# EAGLE design Main-PCB (EAGLE 7.7.0)
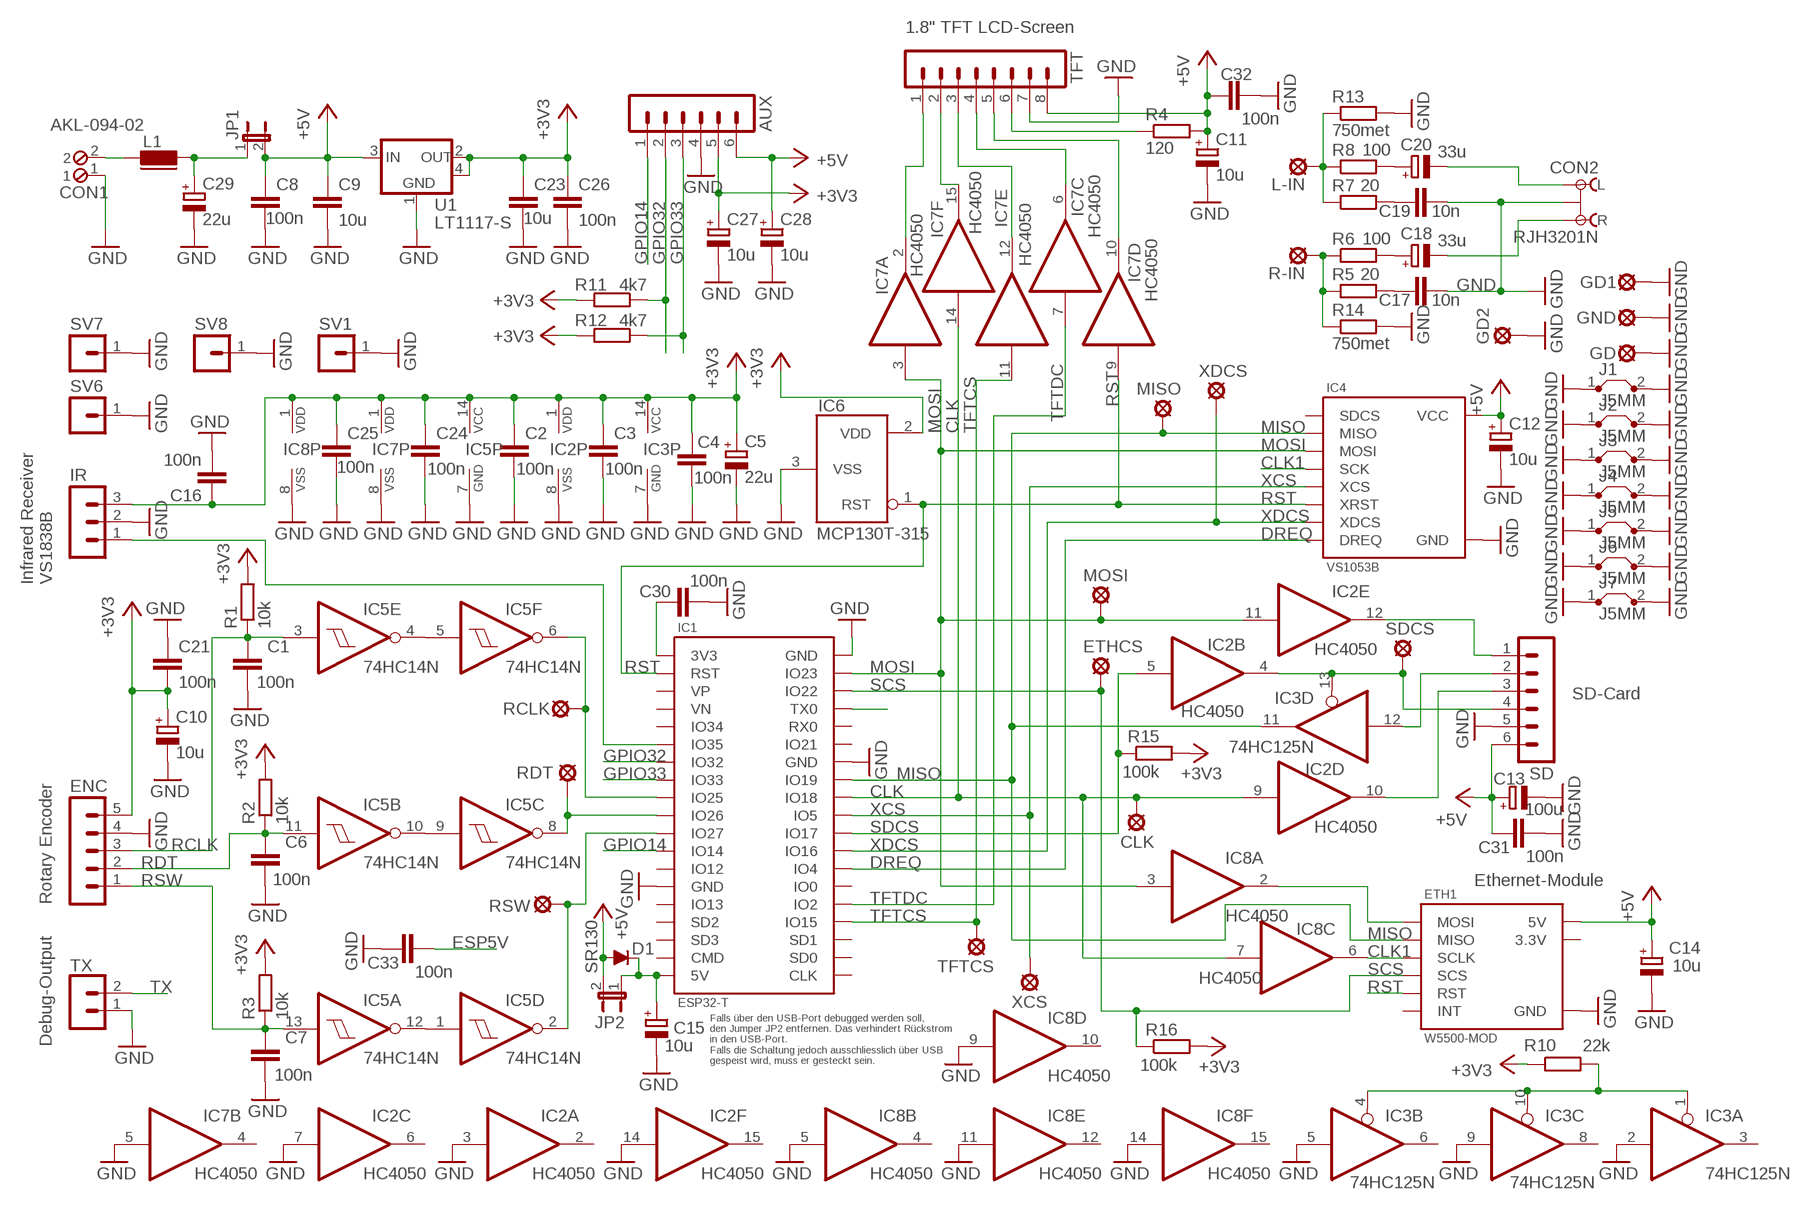
[diagram p0: schematic, sheet 1]

## Parts
AUX  MA06-1  [MA06-1]
C1  100n  C-EU050-024X044  [C050-024X044]
C2  100n  C-EUC1206  [C1206]
C3  100n  C-EUC1206  [C1206]
C4  100n  C-EUC1206  [C1206]
C5  22u  CPOL-EUTT2D4  [TT2D4]
C6  100n  C-EU050-024X044  [C050-024X044]
C7  100n  C-EU050-024X044  [C050-024X044]
C8  100n  C-EUC1206  [C1206]
C9  10u  C-EUC1206  [C1206]
C10  10u  CPOL-EUTT2D4  [TT2D4]
C11  10u  CPOL-EUTT2D4  [TT2D4]
C12  10u  CPOL-EUTT2D4L  [TT2D4L]
C13  100u  CPOL-EUE2.5-6  [E2,5-6]
C14  10u  CPOL-EUTT2D4  [TT2D4]
C15  10u  CPOL-EUTT2D4  [TT2D4]
C16  100n  C-EUC1206  [C1206]
C17  10n  C-EUC1206  [C1206]
C18  33u  CPOL-EUTT2D4  [TT2D4]
C19  10n  C-EUC1206  [C1206]
C20  33u  CPOL-EUTT2D4  [TT2D4]
C21  100n  C-EUC1206  [C1206]
C23  10u  C-EUC1206  [C1206]
C24  100n  C-EUC1206  [C1206]
C25  100n  C-EUC1206  [C1206]
C26  100n  C-EUC1206  [C1206]
C27  10u  CPOL-EUTT2D4  [TT2D4]
C28  10u  CPOL-EUTT2D4  [TT2D4]
C29  22u  CPOL-EUTT2D4  [TT2D4]
C30  100n  C-EUC1206  [C1206]
C31  100n  C-EUC1206  [C1206]
C32  100n  C-EUC1206  [C1206]
C33  100n  C-EUC1206  [C1206]
CLK  LSP11  [LSP11]
CON1  AKL-094-02  [AKL-094-02]
CON2  RJH3201N  [TECHNICS-RJH3201N]
D1  SR130  DIODE-D-7.5  [D-7.5]
ENC  MA05-1  [MA05-1]
ETH1  W5500-MOD  [W5500-MOD]
ETHCS  LSP11  [LSP11]
GD  LSP11  [LSP11]
GD1  LSP11  [LSP11]
GD2  SE13  [SE13]
GND  LSP11  [LSP11]
IC1  ESP32-T  [ESP32-T]
IC2  HC4050  4050N  [DIL16]
IC3  74HC125N  [DIL14]
IC4  VS1053B  [VS1053B]
IC5  74HC14N  [DIL14]
IC6  MCP130T-315  MCP130T-XXXSOT-23  [SOT-23]
IC7  HC4050  4050N  [DIL16]
IC8  HC4050  4050N  [DIL16]
IR  MA03-1  [MA03-1]
J1  J5MM  [05]
J2  J5MM  [05]
J3  J5MM  [05]
J4  J5MM  [05]
J5  J5MM  [05]
J6  J5MM  [05]
J7  J5MM  [05]
JP1  JP1E  [JP1]
JP2  JP1E  [JP1]
L1  07HCP  [07HCP]
L-IN  LSP11  [LSP11]
MISO  LSP11  [LSP11]
MOSI  LSP11  [LSP11]
R1  10k  R-EU_0207/10  [0207/10]
R2  10k  R-EU_0207/10  [0207/10]
R3  10k  R-EU_0207/10  [0207/10]
R4  120  R-EU_0207/10  [0207/10]
R5  20  R-EU_R1206  [R1206]
R6  100  R-EU_R1206  [R1206]
R7  20  R-EU_R1206  [R1206]
R8  100  R-EU_R1206  [R1206]
R10  22k  R-EU_R1206  [R1206]
R11  4k7  R-EU_R1206  [R1206]
R12  4k7  R-EU_R1206  [R1206]
R13  750met  R-EU_0207/10  [0207/10]
R14  750met  R-EU_0207/10  [0207/10]
R15  100k  R-EU_R1206  [R1206]
R16  100k  R-EU_R1206  [R1206]
R-IN  LSP11  [LSP11]
RCLK  LSP11  [LSP11]
RDT  LSP11  [LSP11]
RSW  LSP11  [LSP11]
SD  MA06-1  [MA06-1]
SDCS  LSP11  [LSP11]
SV1  MA01-1  [MA01-1]
SV6  MA01-1  [MA01-1]
SV7  MA01-1  [MA01-1]
SV8  MA01-1  [MA01-1]
TFT  MA08-1  [MA08-1]
TFTCS  LSP11  [LSP11]
TX  MA02-1  [MA02-1]
U1  LT1117-S  [SOT223]
XCS  LSP11  [LSP11]
XDCS  LSP11  [LSP11]

## Nets
+3V3: AUX.5 C2.1 C3.1 C4.1 C5.+ C10.+ C16.1 C21.2 C23.1 C24.1 C25.1 C26.1 C27.+ ENC.5 IC2.1(P:VDD) IC3.14(P:VCC) IC5.14(P:VCC) IC6.2(VDD) IC7.1(P:VDD) IC8.1(P:VDD) IR.3 R1.2 R2.2 R3.2 R10.1 R11.2 R12.2 R15.2 R16.2 U1.2(OUT) U1.4(TAB)
+5V: AUX.6 C8.1 C9.1 C11.+ C12.+ C13.+ C14.+ C28.+ C31.2 C32.2 D1.A ETH1.5V IC4.5V(VCC) JP1.2 JP2.2 R4.2 SD.6 TFT.8 U1.3(IN)
CLK: CLK.MP IC1.IO18 IC2.9(D:I) IC7.14(F:I) IC8.7(C:I)
CLK1: ETH1.SCLK IC4.SCK IC8.6(C:O)
DREQ: IC1.IO4 IC4.DREQ
ESP5V: C15.+ C33.1 D1.C IC1.5V JP2.1
ETHMOSI: ETH1.MOSI IC8.2(A:O)
GND: AUX.4 C1.2 C2.2 C3.2 C4.2 C5.- C6.2 C7.2 C8.2 C9.2 C10.- C11.- C12.- C13.- C14.- C15.- C16.2 C17.2 C19.2 C21.1 C23.2 C24.2 C25.2 C26.2 C27.- C28.- C29.- C30.2 C31.1 C32.1 C33.2 CON1.1 CON2.GND ENC.4 ETH1.GND GD1.MP GD2.MP GD.MP GND.MP IC1.GND IC1.GND1(GND) IC1.GND2(GND) IC2.3(A:I) IC2.7(C:I) IC2.8(P:VSS) IC2.14(F:I) IC3.2(A:I) IC3.5(B:I) IC3.7(P:GND) IC3.9(C:I) IC4.GND IC5.7(P:GND) IC6.3(VSS) IC7.5(B:I) IC7.8(P:VSS) IC8.5(B:I) IC8.8(P:VSS) IC8.9(D:I) IC8.11(E:I) IC8.14(F:I) IR.2 J1.1 J1.2 J2.1 J2.2 J3.1 J3.2 J4.1 J4.2 J5.1 J5.2 J6.1 J6.2 J7.1 J7.2 R13.2 R14.2 SD.5 SV1.1 SV6.1 SV7.1 SV8.1 TFT.7 TX.1 U1.1(GND)
GPIO14: AUX.1 IC1.IO14
GPIO32: AUX.2 IC1.IO32 R11.1
GPIO33: AUX.3 IC1.IO33 R12.1
IR: IC1.IO35 IR.1
MISO: ETH1.MISO IC1.IO19 IC3.11(D:O) IC4.MISO MISO.MP
MOSI: IC1.IO23 IC2.11(E:I) IC4.MOSI IC7.3(A:I) IC8.3(A:I) MOSI.MP
N$1: IC5.1(D:I) IC5.12(A:O)
N$2: IC5.4(E:O) IC5.5(F:I)
N$3: IC5.9(C:I) IC5.10(B:O)
N$4: R4.1 TFT.6
N$5: CON1.2 L1.1
N$6: IC1.IO25 IC5.6(F:O) RCLK.MP
N$7: IC1.IO26 IC5.8(C:O) RDT.MP
N$8: C29.+ JP1.1 L1.2
N$10: IC1.IO27 IC5.2(D:O) RSW.MP
N$11: C30.1 IC1.3V3
N$15: R5.1 R6.1 R14.1 R-IN.MP
N$17: C17.1 R5.2
N$19: C18.+ R6.2
N$20: C18.- CON2.R
N$22: L-IN.MP R7.1 R8.1 R13.1
N$23: C19.1 R7.2
N$25: C20.+ R8.2
N$26: C20.- CON2.L
N$27: IC3.1(A:OE) IC3.4(B:OE) IC3.10(C:OE) R10.2
RCLK: C1.1 ENC.3 IC5.3(E:I) R1.1
RDT: C6.1 ENC.2 IC5.11(B:I) R2.1
RST: ETH1.RST IC1.RST IC4.XRST IC6.1(RST) IC7.9(D:I)
RSW: C7.1 ENC.1 IC5.13(A:I) R3.1
SCS: ETH1.SCS ETHCS.MP IC1.IO22 R16.1
SDCLK: IC2.10(D:O) SD.3
SDCS: IC1.IO17 IC2.5(B:I) R15.1
SDCS1: IC2.4(B:O) IC3.13(D:OE) SD.4 SDCS.MP
SDMISO: IC3.12(D:I) SD.2
SDMOSI: IC2.12(E:O) SD.1
TFTCLK: IC7.15(F:O) TFT.2
TFTCS: IC1.IO15 IC7.11(E:I) TFTCS.MP
TFTCS1: IC7.12(E:O) TFT.3
TFTDC: IC1.IO2 IC7.7(C:I)
TFTDC1: IC7.6(C:O) TFT.4
TFTMOSI: IC7.2(A:O) TFT.1
TFTRST: IC7.10(D:O) TFT.5
TX: IC1.TX0 TX.2
XCS: IC1.IO5 IC4.XCS XCS.MP
XDCS: IC1.IO16 IC4.XDCS XDCS.MP
Unconnected: ETH1.INT IC1.CLK IC1.CMD IC1.IO0 IC1.IO12 IC1.IO13 IC1.IO21 IC1.IO34 IC1.RX0 IC1.SD0 IC1.SD1 IC1.SD2 IC1.SD3 IC1.VN IC1.VP IC2.2(A:O) IC2.6(C:O) IC2.15(F:O) IC3.3(A:O) IC3.6(B:O) IC3.8(C:O) IC4.SDCS IC7.4(B:O) IC8.4(B:O) IC8.10(D:O) IC8.12(E:O) IC8.15(F:O)

## Notes on the sheet
- 1.8" TFT LCD-Screen
- Infrared Receiver
  VS1838B
- SD-Card
- Ethernet-Module
- Rotary Encoder
- Debug-Output
- Falls über den USB-Port debugged werden soll,
  den Jumper JP2 entfernen. Das verhindert Rückstrom
  in den USB-Port.
  Falls die Schaltung jedoch ausschliesslich über USB
  gespeist wird, muss er gesteckt sein.

## Power pins joined to a net without a drawn wire
3.3V: ETH1.3.3V

## Library data of the parts
AUX SD = con-lstb:MA06-1: PIN HEADER; OC_FARNELL: unknown; OC_NEWARK: unknown
C1-C4 C6-C9 C16 C17 C19 C21 C23-C26 C30-C33 = rcl:C-EU: CAPACITOR, European symbol
C5 C10-C15 C18 C20 C27-C29 = rcl:CPOL-EU: POLARIZED CAPACITOR, European symbol
CLK ETHCS GD GD1 GND L-IN MISO MOSI R-IN RCLK RDT RSW SDCS TFTCS XCS XDCS = solpad:LSP11: SOLDER PAD drill 1.1 mm
CON1 = tj-library:AKL-094-02: Riacon AKL-094, Raster 5.08 mm, Polzahl 2
CON2 = tj-library:RJH3201N: RCA Stereo Connector from Technics Tuner ST-G570
D1 = diode:DIODE-: DIODE
ENC = con-lstb:MA05-1: PIN HEADER; OC_FARNELL: unknown; OC_NEWARK: unknown
ETH1 = tj-library:W5500-MOD: Wiznet W5500 Ethernet Modul (China Board)
GD2 = solpad:SE13: SOLDER PAD E1542, drill 1,3mm, distributor Buerklin, 07F815
IC1 = tj-library:ESP32-T: ESP32-T (China Board with ESP32-Bit Modul)
IC2 IC7 IC8 = 40xx:4050: Hex non-inverting BUFFER
IC3 = 74xx-eu:74*125: Quad bus BUFFER, 3-state
IC4 = tj-library:VS1053B: VS1053B Audio Module (China Board)
IC5 = 74xx-eu:74*14: Hex schmitt trigger INVERTER
IC6 = tj-library:MCP130T-XXX: Microcontroller Supervisory Circuit with Open Drain Output
IR = con-lstb:MA03-1: PIN HEADER; OC_FARNELL: unknown; OC_NEWARK: unknown
J1-J7 = jumper:J: Bridge
JP1 JP2 = jumper:JP1E: JUMPER
L1 = inductor-fastron:07HCP: Fastron Inductor 07HCP
R1-R8 R10-R16 = rcl:R-EU_: RESISTOR, European symbol
SV1 SV6-SV8 = tj-library:MA01-1: PIN HEADER
TFT = con-lstb:MA08-1: PIN HEADER; OC_FARNELL: unknown; OC_NEWARK: unknown
TX = tj-library:MA02-1: PIN HEADER
U1 = v-reg:LT1117: 800mA LDO Positive Regulator Fixed 2.85V, 3.3V, 5V

## Net classes
0 default: width 0.406 mm, clearance 0.305 mm
1 Stromversorgung: width 0.406 mm, clearance 0.356 mm
2 Stromversorgung 2: width 0.813 mm, clearance 0.406 mm

## Board
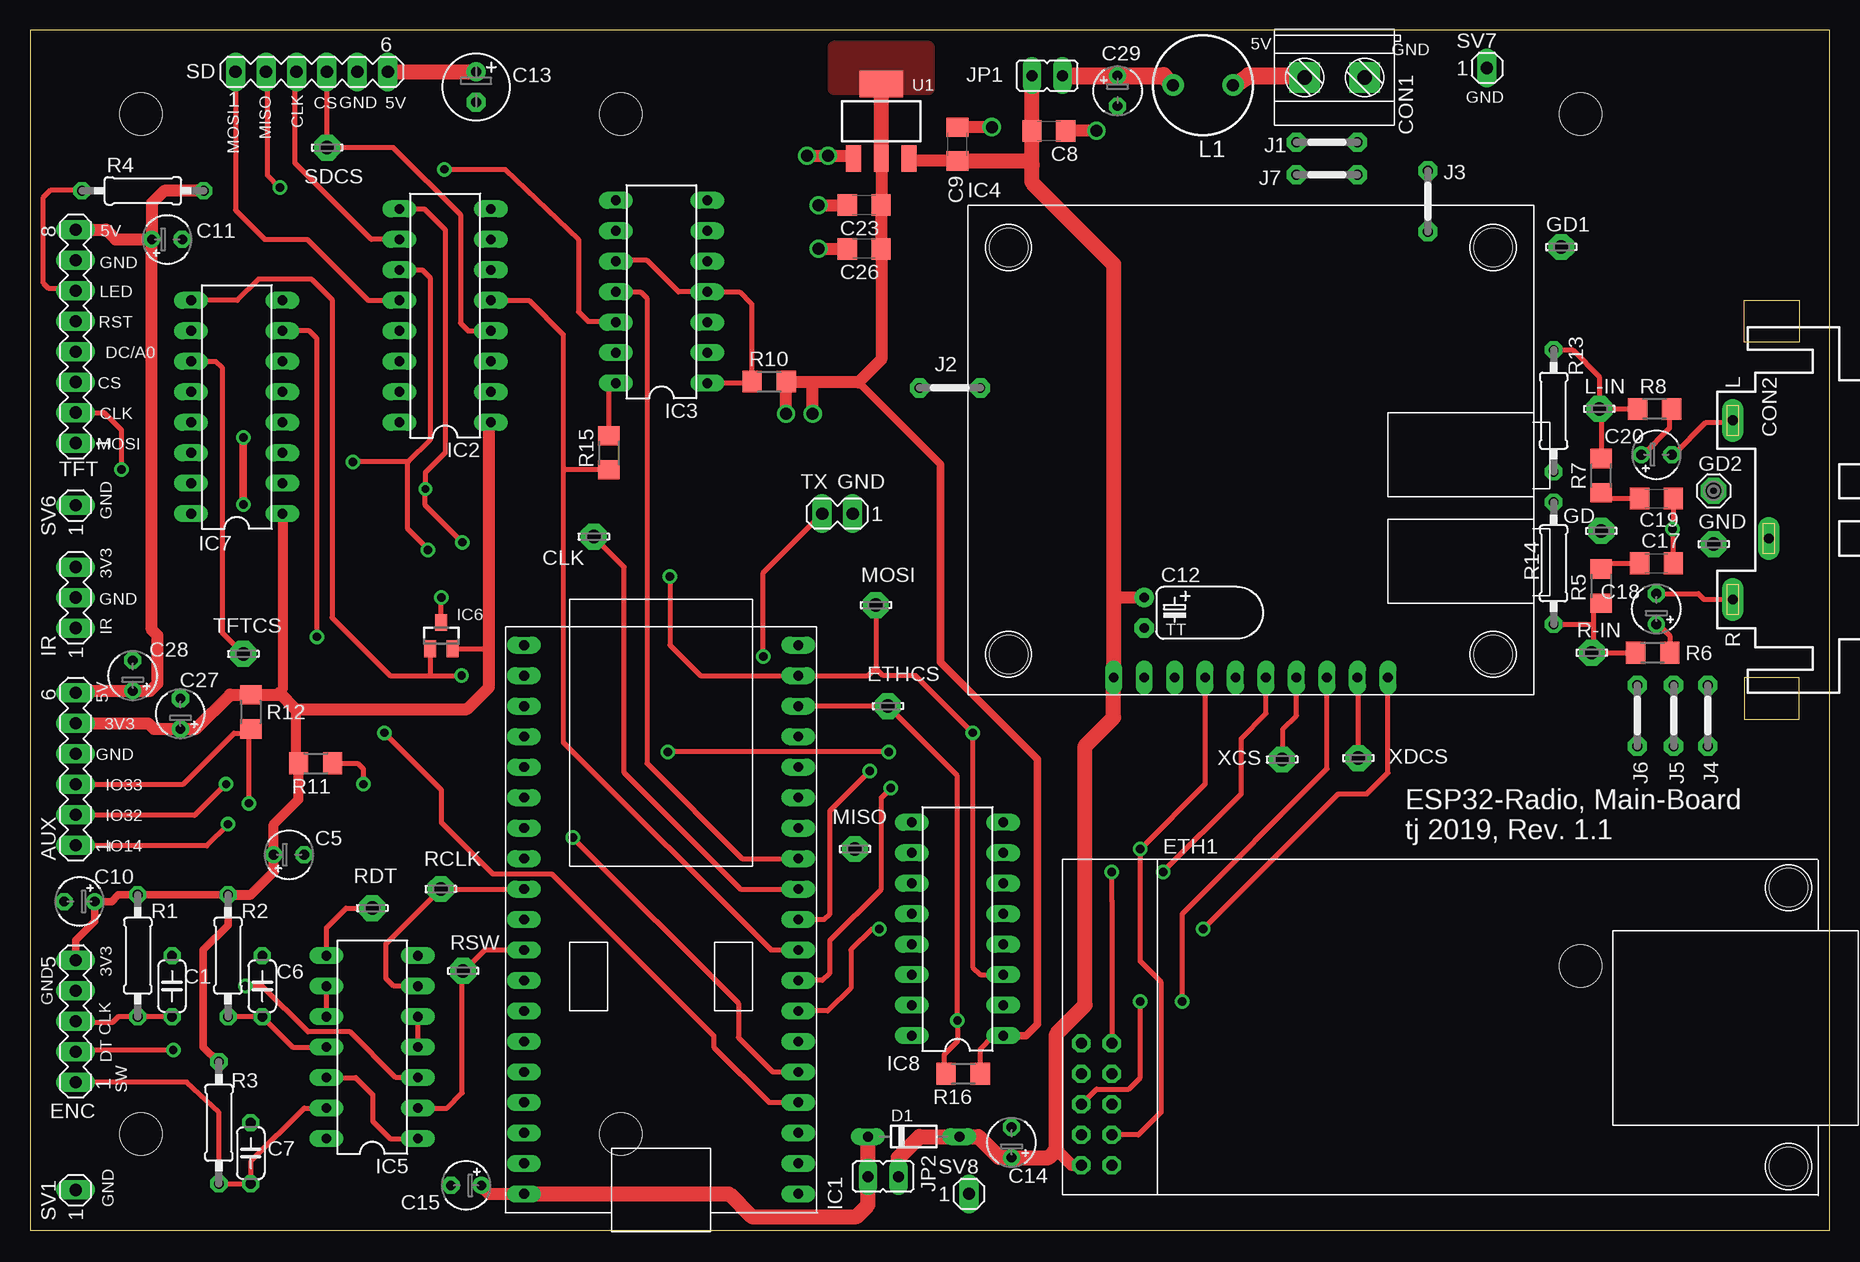
[diagram p1: board, top side]
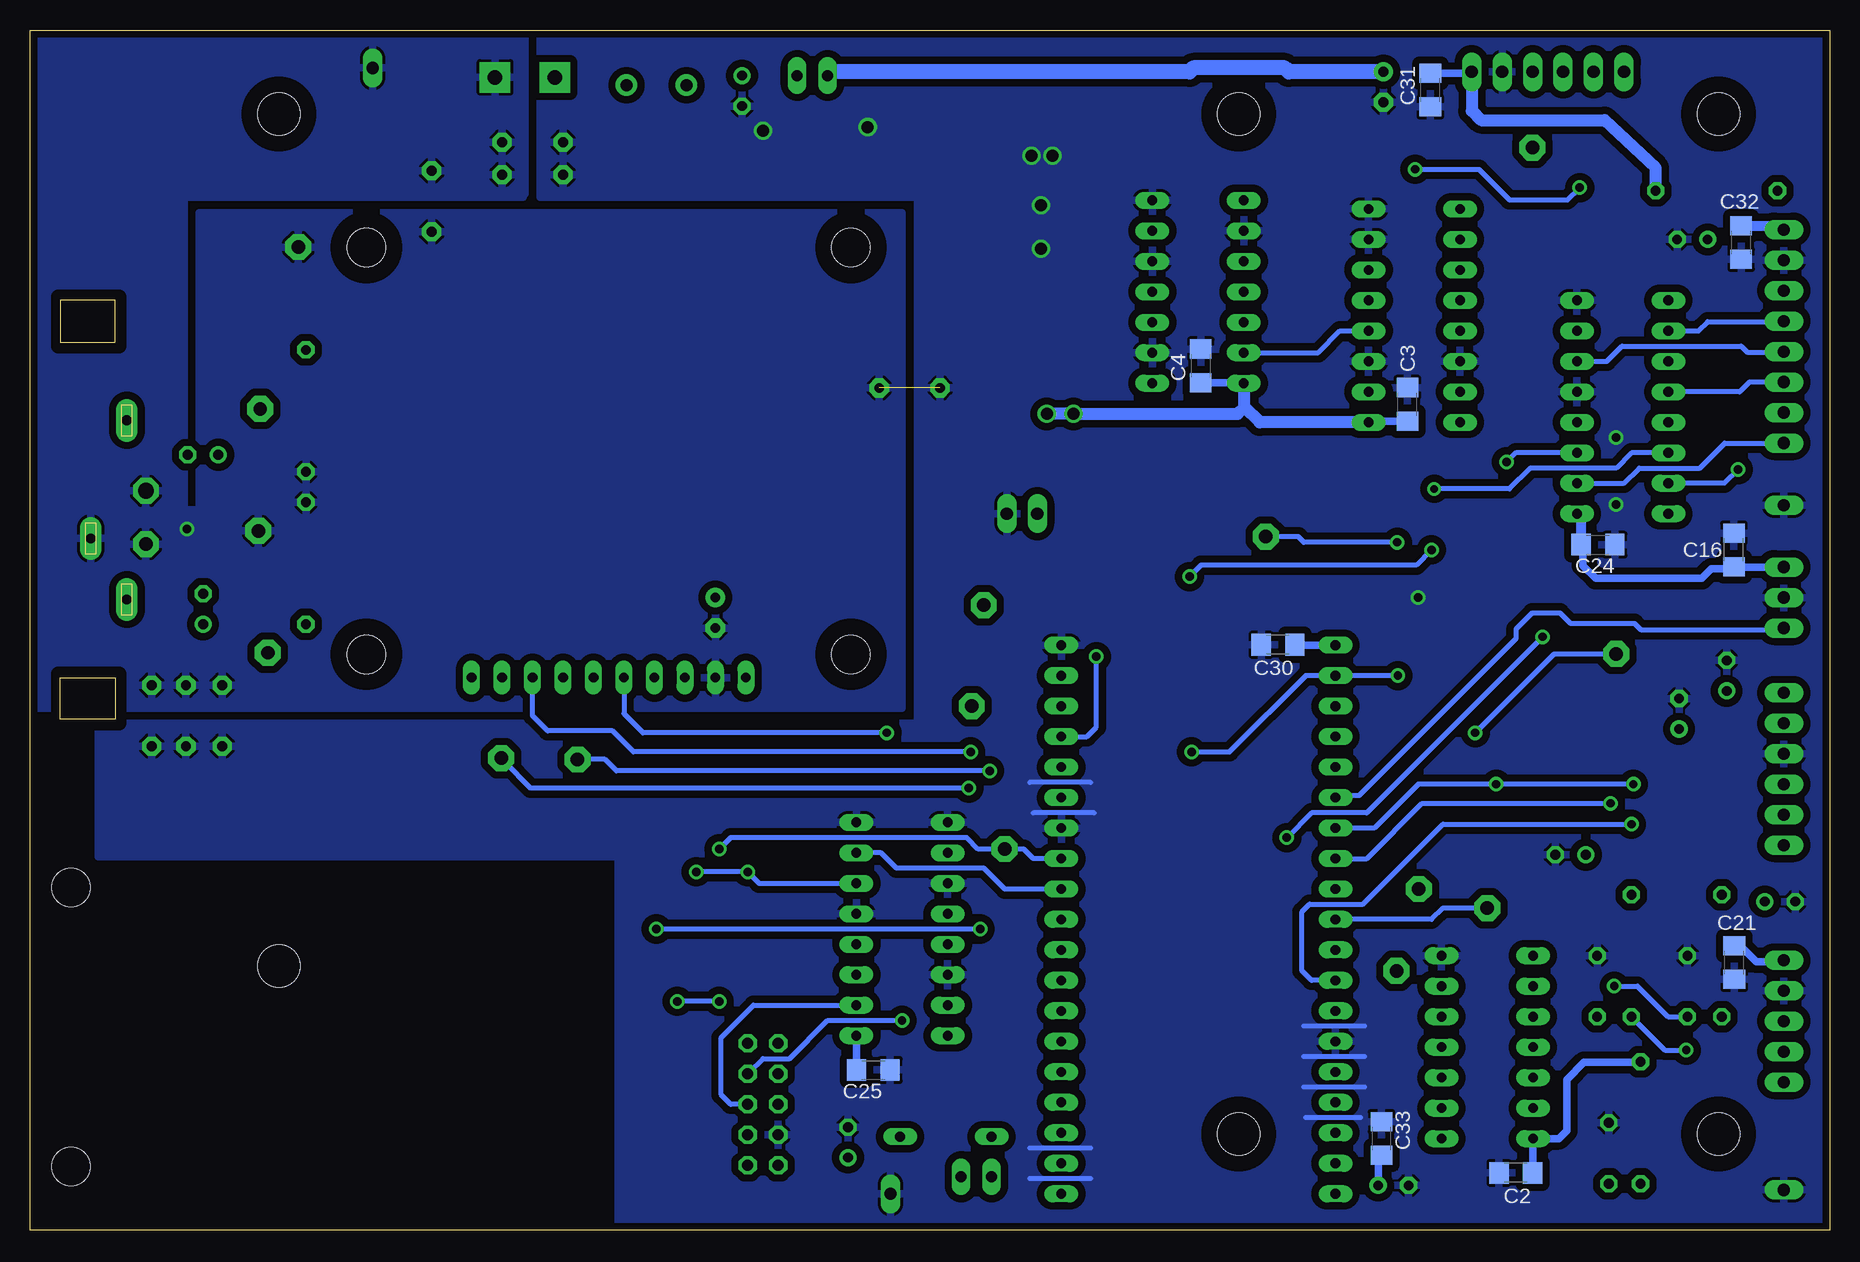
[diagram p2: board, bottom side, seen from below]

Size 150 x 100 mm. Coordinates in mm from the lower left corner, seen from the top.
Outline: 0,0 150,0 150,100 0,100 0,0
Copper layers (1*16): Top 0.035mm / dielectric 1.5mm / Bottom 0.035mm
Design rules "default *": minimum track width 10mil, minimum drill 24mil, track to track 8mil, track to pad 8mil, pad to pad 8mil, via to via 8mil, smd to smd 8mil, copper to edge 16mil, drill to drill 8mil, minimum pad ring 12mil, minimum via ring 10mil, stop-mask expansion 4mil, vias tented up to drill 0mil, thermal gap 10mil
Holes 3.5 mm at 129.25,93 9.25,93 49.25,93 49.25,8 9.25,8 129.25,22
tRestrict: area 127.5,91.2 to 131,94.8; area 7.5,91.2 to 11,94.8; area 47.5,91.2 to 51,94.8; area 47.5,6.2 to 51,9.8; area 7.5,6.2 to 11,9.8; area 127.5,20.2 to 131,23.8
bRestrict: area 127.5,91.2 to 131,94.8; area 7.5,91.2 to 11,94.8; area 47.5,91.2 to 51,94.8; area 47.5,6.2 to 51,9.8; area 7.5,6.2 to 11,9.8; area 127.5,20.2 to 131,23.8
vRestrict: area 127.5,91.2 to 131,94.8; area 7.5,91.2 to 11,94.8; area 47.5,91.2 to 51,94.8; area 47.5,6.2 to 51,9.8; area 7.5,6.2 to 11,9.8; area 127.5,20.2 to 131,23.8

### Footprints (pad centres in the part's own frame; a part is rotated, then mirrored left to right if it is on the bottom)
MA06-1 = drill 1.016 long: 1 -6.35,0; 2 -3.81,0; 3 -1.27,0; 4 1.27,0; 5 3.81,0; 6 6.35,0
C050-024X044 = drill 0.813 octagon: 1 -2.54,0; 2 2.54,0
C1206 = smd 1.6 x 1.8: 1 -1.4,0; 2 1.4,0
TT2D4 = drill 0.813: + -1.27,0 | drill 0.813 octagon: - 1.27,0
TT2D4L = drill 0.813 pad 1.6: + -1.27,0 | drill 0.813 pad 1.6 octagon: - 1.27,0
E2,5-6 = drill 0.813 pad 1.6: + -1.27,0 | drill 0.813 pad 1.6 octagon: - 1.27,0
LSP11 = drill 1.118 pad 2.159 octagon: MP 0,0
AKL-094-02 = drill 1.2 pad 2.54 square: 1 -2.5,0; 2 2.5,0
TECHNICS-RJH3201N = drill 0.813 pad 1.778 long: GND 2.381,-2.056; L -7.461,-5.072; R 7.461,-5.072
D-7.5 = drill 0.813 long: A 3.81,0; C -3.81,0
MA05-1 = drill 1.016 long: 1 -5.08,0; 2 -2.54,0; 3 0,0; 4 2.54,0; 5 5.08,0
W5500-MOD = drill 0.914 octagon: 3.3V 11.43,-25.4; 5V 11.43,-27.94; GND 8.89,-27.94; INT 3.81,-27.94; MISO 8.89,-25.4; MOSI 6.35,-25.4; NC 1.27,-27.94; RST 6.35,-27.94; SCLK 1.27,-25.4; SCS 3.81,-25.4 | hole 3.2: 11.541,31.004; -11.7,31.004
SE13 = drill 1.321 pad 2.159 octagon: MP 0,0
ESP32-T = drill 0.813 long: 3V3 22.86,11.43; 5V -22.86,11.43; CLK -22.86,-11.43; CMD -20.32,11.43; GND 7.62,-11.43; GND1 22.86,-11.43; GND2 -10.16,11.43; IO0 -10.16,-11.43; IO2 -12.7,-11.43; IO4 -7.62,-11.43; IO5 0,-11.43; IO12 -7.62,11.43; IO13 -12.7,11.43; IO14 -5.08,11.43; IO15 -15.24,-11.43; IO16 -5.08,-11.43; IO17 -2.54,-11.43; IO18 2.54,-11.43; IO19 5.08,-11.43; IO21 10.16,-11.43; IO22 17.78,-11.43; IO23 20.32,-11.43; IO25 2.54,11.43; IO26 0,11.43; IO27 -2.54,11.43; IO32 7.62,11.43; IO33 5.08,11.43; IO34 12.7,11.43; IO35 10.16,11.43; RST 20.32,11.43; RX0 12.7,-11.43; SD0 -20.32,-11.43; SD1 -17.78,-11.43; SD2 -15.24,11.43; SD3 -17.78,11.43; TX0 15.24,-11.43; VN 15.24,11.43; VP 17.78,11.43
DIL16 = drill 0.813 long: 1 -8.89,-3.81; 2 -6.35,-3.81; 3 -3.81,-3.81; 4 -1.27,-3.81; 5 1.27,-3.81; 6 3.81,-3.81; 7 6.35,-3.81; 8 8.89,-3.81; 9 8.89,3.81; 10 6.35,3.81; 11 3.81,3.81; 12 1.27,3.81; 13 -1.27,3.81; 14 -3.81,3.81; 15 -6.35,3.81; 16 -8.89,3.81
DIL14 = drill 0.813 long: 1 -7.62,-3.81; 2 -5.08,-3.81; 3 -2.54,-3.81; 4 0,-3.81; 5 2.54,-3.81; 6 5.08,-3.81; 7 7.62,-3.81; 8 7.62,3.81; 9 5.08,3.81; 10 2.54,3.81; 11 0,3.81; 12 -2.54,3.81; 13 -5.08,3.81; 14 -7.62,3.81
VS1053B = drill 0.813 long: 5V -11.43,-18.891; DREQ 11.43,-18.891; GND -8.89,-18.891; MISO -3.81,-18.891; MOSI -1.27,-18.891; SCK 1.27,-18.891; SDCS -6.35,-18.891; XCS 3.81,-18.891; XDCS 8.89,-18.891; XRST 6.35,-18.891 | hole 3.2: 20.193,-16.954; -20.193,-16.954; 20.193,16.954; -20.193,16.954
SOT-23 = smd 1 x 1.4: 1 -0.95,-1.1; 2 0.95,-1.1; 3 0,1.1
MA03-1 = drill 1.016 long: 1 -2.54,0; 2 0,0; 3 2.54,0
05 = drill 0.813 pad 1.6 octagon: 1 -2.54,0; 2 2.54,0
JP1 = drill 0.914 long: 1 0,-1.27; 2 0,1.27
07HCP = drill 1 pad 1.778: 1 -2.5,0; 2 2.5,0
0207/10 = drill 0.813 octagon: 1 -5.08,0; 2 5.08,0
R1206 = smd 1.6 x 1.803: 1 -1.422,0; 2 1.422,0
MA01-1 = drill 1.016 long: 1 0,0
MA08-1 = drill 1.016 long: 1 -8.89,0; 2 -6.35,0; 3 -3.81,0; 4 -1.27,0; 5 1.27,0; 6 3.81,0; 7 6.35,0; 8 8.89,0
MA02-1 = drill 1.016 long: 1 -1.27,0; 2 1.27,0
SOT223 = smd 1.219 x 2.235: 1 -2.311,-3.099; 2 0,-3.099; 3 2.311,-3.099 | smd 3.6 x 2.2: 4 0,3.099

### Placement (x,y rotation side)
AUX  3.81,38.42 90 top
C1  11.84,20.32 90 top
C2  26.15,4.76 180 bottom
C3  35.18,68.8 90 bottom
C4  52.4,72.01 90 bottom
C5  21.59,31.27 0 top
C6  19.37,20.32 90 top
C7  18.4,6.4 90 top
C8  84.93,91.6 0 top
C9  77.31,90.49 90 top
C10  4.13,27.37 180 top
C11  11.43,82.55 0 top
C12  92.87,51.44 270 top
C13  37.18,95.25 270 top
C14  81.82,7.3 90 top
C15  36.35,3.71 180 top
C16  7.97,56.67 90 bottom
C17  135.57,55.56 0 top
C18  135.57,51.75 90 top
C19  135.57,60.96 0 top
C20  135.57,64.61 0 top
C21  7.94,22.29 90 bottom
C23  69.53,85.41 180 top
C24  19.3,57.12 0 bottom
C25  79.71,13.34 0 bottom
C26  69.53,81.76 180 top
C27  12.54,43.02 90 top
C28  8.57,46.2 90 top
C29  90.65,94.93 270 top
C30  45.97,48.77 180 bottom
C31  33.27,95 90 bottom
C32  7.37,82.3 90 bottom
C33  37.34,7.62 90 bottom
CLK  46.99,57.78 0 top
CON1  108.75,96.04 180 top
CON2  147,60.01 270 top
D1  73.66,7.78 0 top
ENC  3.81,17.4 90 top
ETH1  115.57,16.83 270 top
ETHCS  71.5,43.66 0 top
GD  130.97,58.26 0 top
GD1  127.64,81.92 0 top
GD2  140.34,61.59 0 top
GND  140.34,57.15 0 top
IC1  52.61,25.88 90 top
IC2  34.61,76.2 90 top
IC3  52.64,78.19 90 top
IC4  101.76,64.93 0 top
IC5  28.53,15.24 90 top
IC6  34.29,49.53 0 top
IC7  17.24,68.58 90 top
IC8  77.31,25.08 90 top
IR  3.81,52.7 90 top
J1  108.11,90.65 0 top
J2  76.68,70.17 0 top
J3  116.52,85.72 90 top
J4  139.86,42.86 270 top
J5  137,42.86 270 top
J6  133.99,42.86 270 top
J7  108.11,87.95 180 top
JP1  84.77,96.2 90 top
JP2  71.12,4.45 270 top
L1  97.79,95.41 180 top
L-IN  130.81,68.42 0 top
MISO  68.75,31.75 0 top
MOSI  70.5,52.07 0 top
R1  8.99,22.86 90 top
R2  16.51,22.86 90 top
R3  15.75,8.94 90 top
R4  9.41,86.6 0 top
R5  130.97,53.66 90 top
R6  135.26,48.1 0 top
R7  130.97,62.86 270 top
R8  135.41,68.42 0 top
R10  61.62,70.7 180 top
R11  23.81,38.89 180 top
R12  18.41,43.18 90 top
R13  127,68.26 270 top
R14  127,55.56 90 top
R15  48.26,64.77 90 top
R16  77.79,13.02 0 top
R-IN  130.18,48.1 0 top
RCLK  34.24,28.42 0 top
RDT  28.53,26.83 0 top
RSW  36.1,21.59 0 top
SD  23.48,96.52 0 top
SDCS  24.77,90.2 0 top
SV1  3.81,3.33 90 top
SV6  3.81,60.39 90 top
SV7  121.44,96.84 0 top
SV8  78.26,3.02 0 top
TFT  3.81,74.47 90 top
TFTCS  17.78,48.01 0 top
TX  67.31,59.69 180 top
U1  70.96,92.39 0 top
XCS  104.36,39.21 0 top
XDCS  110.71,39.32 0 top

### Tracks (layer width: path | path; a pad name or v marks a point on that pad's centre or on a via)
+3V3  (via drill 1)
  Top 0.406: R16.2 79.21,15.07 80.33,16.19 IC8.1 | R15.2 48.26,69.99 IC3.14 | IC6.2 38.25,48.43 38.26,48.42
  Top 0.61: IC8.1 83.03,16.19 83.98,17.14 83.98,39.21 75.88,47.31 75.88,63.82 69.06,70.64 | ENC.5 3.81,24.13 5.4,25.72 C10.+ 6.79,27.37 7.37,27.94 R1.2 R2.2 16.51,25.4 14.45,23.34 14.45,15.24 15.67,14.02 R3.2 | R11.2 22.15,39.13
  Top 0.813: 38.26,67.15 IC2.1 | R2.2 18.41,27.94 20.32,29.84 C5.+ 20.32,33.81 22.38,35.88 R11.2 | 20.63,44.6 20.8,44.77 21.05,45.02 IC7.1 | 22.15,43.41 22.15,39.13
  Top 1.016: v63.02,68.01 63.02,70.68 R10.1 63.09,70.64 65.25,70.64 | 65.25,70.64 69.06,70.64 70.96,72.55 70.96,81.73 C26.1 C23.1 70.96,85.44 U1.2 | 38.26,67.15 38.26,48.42 38.26,45.24 36.42,43.41 22.15,43.41 20.8,44.77 | v65.25,68.01 65.25,70.64 | AUX.5 9.84,42.23 10.32,41.75 C27.+ 13.81,41.75 16.67,44.61 R12.2 20.63,44.6
  Top 1.27: U1.2 U1.4
  Bottom 0.406: 7.62,55.24 C16.1
  Bottom 0.61: IR.3 7.62,55.24 | 8.26,55.24 C16.1 8.15,55.09 9.84,55.09 10.64,54.29 19.49,54.29 20.57,55.37 20.57,56.8 C24.1 | C25.1 81.11,15.7 IC8.1 | 38.45,67.28 IC2.1 38.33,67.4 C3.1 | C2.1 24.75,7.59 | IC5.14 22.54,7.62 21.91,8.26 21.91,12.54 20.48,13.97 15.79,13.97 | 3.87,22.54 ENC.5 3.94,22.35 6.1,22.35 7.43,23.69 C21.2 | C4.1 48.88,70.61 IC3.14
  Bottom 0.813: 24.75,7.59 IC5.14 | 15.79,13.97 R3.2 | C24.1 20.7,59.6 IC7.1
  Bottom 1.016: IC2.1 47.5,67.31 48.77,68.58 | v65.25,68.01 v63.02,68.01 49.34,68.01 48.77,68.58 | 48.77,68.58 48.77,70.5 IC3.14
  pour Top: 66.99,95.09 74.93,95.09 74.93,98.58 66.99,98.58
+5V
  Top 1.016: ETH1.5V 86.84,5.4 85.57,6.67 | 90.33,46.36 IC4.5V 90.33,46.35 | C12.+ 90.49,52.7 90.33,52.55 | C11.+ 10.16,50.01 10.64,49.53 10.64,45.56 10,44.93 C28.+ 3.97,44.93 AUX.6 | R4.2 11.19,86.6 10.16,85.57 C11.+ | TFT.8 6.33,83.36 7.14,82.55 C11.+ | C9.1 73.48,89.09 U1.3
  Top 1.27: SD.6 C13.+ | 90.33,46.36 90.33,52.55 90.33,80.49 83.53,87.28 83.53,88.74 | 90.33,46.35 90.33,42.7 87.95,40.32 87.95,18.73 85.57,16.35 85.57,6.67 84.93,6.03 C14.+ 80.8,6.03 79.06,7.78 D1.A 74.14,7.78 72.39,6.03 JP2.2 | 83.53,88.74 C8.1 83.53,96.17 JP1.2 | C9.1 83.19,89.09 83.53,88.74
  Bottom 0.61: C31.2 29.95,96.4 SD.6
  Bottom 0.813: 3.89,83.44 TFT.8 4.15,83.7 C32.2
  Bottom 1.016: SD.6 29.83,93.27 29.05,92.49 18.73,92.49 14.49,88.5 R4.2
  Bottom 1.27: C13.+ 45.09,96.52 45.4,96.84 53.02,96.84 53.34,96.52 83.19,96.52 JP1.2
CLK  (via drill 0.61, 0.7)
  Top 0.406: IC2.9 32.86,85.09 34.61,83.34 34.61,64.77 32.96,63.12 v32.96,61.75 32.96,60.39 v36.04,57.31 | IC1.IO18 59.21,28.42 49.53,38.1 49.53,55.24 CLK.MP
  Bottom 0.406: IC1.IO18 68.74,28.42 70.48,30.16 77.79,30.16 79.06,31.43 IC8.7 | IC7.14 16.51,64.77 17.78,63.5 24.92,63.5 26.67,61.75 v32.96,61.75 | v36.04,57.31 43.81,57.31 44.29,57.78 CLK.MP
CLK1  (via drill 0.7)
  Top 0.406: v90.17,29.84 90.17,27.46 ETH1.SCLK | v94.46,29.84 100.97,36.35 100.97,40.96 103.03,43.02 103.03,45.72 IC4.SCK
  Bottom 0.406: IC8.6 89.22,28.89 v90.17,29.84 v94.46,29.84
DREQ  (via drill 0.7)
  Top 0.406: v97.79,25.08 109.06,36.35 111.44,36.35 113.19,38.1 113.19,45.56 IC4.DREQ | v70.8,25.08 70.17,25.08 68.42,23.34 68.42,20.16 66.52,18.26 IC1.IO4
  Bottom 0.406: v70.8,25.08 v97.79,25.08
ESP5V
  Top 1.016: C15.+ 37.62,3.65 38.26,3.02 IC1.5V
  Top 1.27: IC1.5V 58.26,3.02 60.17,1.11 68.9,1.11 69.85,2.06 JP2.1 D1.C
  Bottom 0.61: C15.+ 37.59,3.75 37.59,5.97 C33.1
ETHMOSI
  Bottom 0.406: IC8.2 89.69,18.73 92.39,16.03 92.39,11.27 91.6,10.48 ETH1.MOSI
GND  (via drill 0.7, 1)  (1 unrouted)
  Top 0.406: 68.63,89.26 U1.1 | C19.2 136.97,58.48 v136.91,58.42 136.97,58.35 C17.2 | IC6.3 v34.29,52.7
  Top 0.61: v17.78,66.04 v17.78,60.45
  Top 1.016: v88.9,91.6 C8.2 | v65.72,85.41 C23.2 | v65.72,81.76 C26.2 | U1.1 68.41,89.53 v66.52,89.53 v64.77,89.53 | v80.17,91.92 77.34,91.92 C9.2
  Bottom 0.406: 38.73,14.45 43.81,14.45 | 38.73,11.91 43.81,11.91 | 39.08,9.37 43.66,9.37 | 61.59,6.83 66.67,6.83 | 61.59,4.29 66.67,4.29 | 61.28,34.77 66.36,34.77 | 61.59,37.31 66.67,37.31 | 38.73,16.99 43.81,16.99
  pour Bottom (isolate 0.61): 0,0 100.97,0 100.97,31.11 144.3,31.11 144.3,42.23 76.04,42.23 76.04,86.04 107.47,86.04 107.47,100.33 0,100.33
  pour Bottom (isolate 0.61): 108.74,100.33 150.02,100.33 150.02,43.5 77.31,43.5 77.31,84.77 135.89,84.77 135.89,60.01 137.16,60.01 137.16,86.04 108.9,86.04 108.9,86.52 108.74,86.36
GPIO14  (via drill 0.7)
  Top 0.406: v16.51,33.81 16.51,33.78 14.73,32 3.87,32 AUX.1
  Bottom 0.406: IC1.IO14 43.18,20.8 43.97,21.59 43.97,26.51 43.34,27.15 38.89,27.15 32.23,33.81 v16.51,33.81
GPIO32  (via drill 0.7)
  Top 0.406: R11.1 27.3,38.89 27.78,38.42 v27.78,37.15 | v16.35,37.15 16.32,37.15 13.72,34.54 3.87,34.54 AUX.2
  Bottom 0.406: IC1.IO32 37.94,33.5 34.29,37.15 v27.78,37.15 v16.35,37.15
GPIO33  (via drill 0.7)
  Top 0.406: R12.1 | v18.26,35.56 18.26,41.6 R12.1 | AUX.3 12.76,37.15 17.02,41.4 18.06,41.4 R12.1
  Bottom 0.406: IC1.IO33 38.58,30.96 33.97,35.56 v18.26,35.56
IR
  Bottom 0.406: IC1.IO35 40.86,36.2 39.21,36.2 26.13,49.28 26.13,50.07 24.77,51.44 22.48,51.44 21.59,50.55 16.26,50.55 15.75,50.04 3.94,50.04 IR.1
MISO  (via drill 0.7)
  Top 0.406: ETH1.MISO 92.39,7.94 94.3,9.84 94.3,20.64 92.55,22.38 v92.55,31.75 97.95,37.15 IC4.MISO | IC3.11 50.88,78.19 51.44,77.63 51.44,38.89 59.37,30.96 IC1.IO19
  Bottom 0.406: IC1.IO19 66.36,30.96 67.15,31.75 MISO.MP 70.96,31.75 71.91,32.7 91.6,32.7 v92.55,31.75
MOSI  (via drill 0.7)
  Top 0.406: IC8.3 79.22,21.27 78.58,21.91 v78.58,41.43 73.82,46.2 71.12,46.2 70.48,46.83 | IC2.11 32.7,80.01 33.34,79.38 33.34,65.82 31.53,64.01 | 31.53,64.01 v26.92,64.01 | MOSI.MP 70.5,46.85 70.48,46.83 | 70.48,46.83 69.85,46.2 IC1.IO23 55.88,46.2 53.34,48.74 v53.34,54.45 | v33.18,56.67 33.18,56.74 31.5,58.42 31.5,63.98 31.53,64.01
  Bottom 0.406: IC4.MOSI 100.49,43.02 98.9,41.43 v78.58,41.43 | v33.18,56.67 34.45,55.4 52.39,55.4 v53.34,54.45 | IC7.3 26.16,64.77 v26.92,64.01
N$1
  Top 0.406: IC5.12 27.15,12.7 28.57,11.27 28.57,9.05 30,7.62 IC5.1
N$2
  Top 0.406: IC5.4 IC5.5
N$3
  Top 0.406: IC5.10 IC5.9
N$4
  Top 0.406: R4.1 4.25,86.68 1.75,86.68 1.11,86.04 1.11,78.9 1.52,78.49 3.6,78.49 TFT.6
N$5
  Top 1.27: L1.1 100.65,95.57
  Top 1.422: 100.65,95.57 101.6,96.2 105.61,96.2 CON1.2
N$6
  Top 0.406: IC5.6 30.32,20.32 29.69,20.95 29.69,23.86 RCLK.MP IC1.IO25
N$7
  Top 0.406: IC5.8 24.72,25.19 26.35,26.83 RDT.MP
  Bottom 0.406: RDT.MP 32.23,26.83 33.18,25.88 IC1.IO26
N$8
  Top 1.422: JP1.1 C29.+ 94.5,96.2 L1.2
N$10
  Top 0.406: IC5.2 34.77,10.16 36.04,11.43 36.04,21.53 RSW.MP 36.2,21.59 37.94,23.34 IC1.IO27
N$11
  Bottom 0.406: 44.57,48.74 C30.1
  Bottom 0.61: IC1.3V3 44.57,48.74
N$15
  Top 0.406: 130.33,50.48 130.33,48.1 R-IN.MP R6.1 | 130.33,50.48 130.33,52.07 130.97,52.7 R5.1 | R14.1 130.33,50.48
N$17
  Top 0.406: C17.1 131.13,55.56 R5.2
N$19
  Top 0.406: 136.84,48.1 R6.2 136.68,49.53 135.73,50.48 C18.+
N$20
  Top 0.406: C18.- 139.06,53.02 139.54,52.55 CON2.R
N$22
  Top 0.406: L-IN.MP R8.1 | L-IN.MP 130.97,68.58 R7.1 | R13.1 128.59,73.34 130.81,71.12 L-IN.MP
N$23
  Top 0.406: C19.1 130.81,60.96 R7.2
N$25
  Top 0.406: R8.2 136.68,68.27 136.68,66.83 134.46,64.61 C20.+
N$26
  Top 0.406: C20.- 137,64.61 139.7,67.31 141.77,67.31 CON2.L
N$27
  Top 0.406: 60.17,70.57 60.17,77.15 59.13,78.19 IC3.4 54.05,78.19 51.44,80.8 48.91,80.8 IC3.10 | 60.17,70.57 R10.2 | 60.17,70.57 IC3.1
RCLK  (via drill 0.7)
  Top 0.406: IC5.3 30.48,12.7 26.67,16.51 23.18,16.51 19.37,20.32 v17.94,20.32 | C1.1 R1.1 7.37,17.78 6.86,17.27 3.94,17.27 ENC.3
  Bottom 0.406: v17.94,20.32 16,20.32 13.46,17.78 C1.1
RDT  (via drill 0.7)
  Top 0.406: R2.1 C6.1 21.91,15.24 IC5.11 | v11.94,14.99 3.94,14.99 ENC.2
  Bottom 0.406: R2.1 13.72,14.99 v11.94,14.99
RST  (via drill 0.7)
  Top 0.406: IC7.9 17.27,77.47 19.05,79.25 23.46,79.25 25.18,77.53 25.18,51.02 30,46.2 33.34,46.2 | ETH1.RST 88.9,11.75 91.6,11.75 92.55,12.7 v92.55,19.05 | 33.34,46.2 v35.98,46.2 | v71.6,39.85 v53.18,39.85 | v96.04,19.05 96.04,26.35 108.11,38.42 108.11,45.56 IC4.XRST | IC6.1 33.34,46.2
  Bottom 0.406: v92.55,19.05 v96.04,19.05 | IC4.XRST 108.11,45.4 108.11,42.86 106.84,41.59 101.44,41.59 99.69,39.85 v71.6,39.85 | v53.18,39.85 50.01,39.85 43.66,46.2 IC1.RST v35.98,46.2
RSW
  Top 0.406: IC5.13 22.86,10.16 18.41,5.71 18.41,3.87 C7.1 R3.1 15.72,3.89 15.72,9.84 13.08,12.32 ENC.1
SCS  (via drill 0.7)
  Top 0.406: IC1.IO22 ETHCS.MP 77.31,37.85 v77.31,17.46 77.31,15.72 76.2,14.61 76.2,13.18 R16.1
  Bottom 0.406: ETH1.SCS 90.01,13.18 88.9,14.29 86.68,14.29 83.5,17.46 v77.31,17.46
SDCLK
  Top 0.406: IC2.10 28.45,82.55 22.1,88.9 22.1,96.41 SD.3
SDCS
  Top 0.406: 44.45,63.5 44.45,74.61 41.59,77.47 IC2.5 | 44.45,63.5 44.45,40.64 61.75,23.34 IC1.IO17 | R15.1 44.6,63.35 44.45,63.5
SDCS1
  Top 0.406: IC2.4 36.51,74.93 35.88,75.56 35.88,84.61 30.29,90.2 SDCS.MP 24.77,96.5 SD.4
  Bottom 0.406: IC3.13 42.62,73.11 40.8,74.93 IC2.4
SDMISO  (via drill 0.7)
  Top 0.406: v34.54,88.39 39.62,88.39 45.72,82.55 45.72,76.52 46.51,75.72 48.75,75.72 IC3.12 | v20.83,86.87 19.81,87.88 19.81,96.38 SD.2
  Bottom 0.406: v34.54,88.39 29.21,88.39 26.67,85.85 21.84,85.85 v20.83,86.87
SDMOSI
  Top 0.406: SD.1 17.13,84.98 19.56,82.55 23.11,82.55 28.19,77.47 IC2.12
TFTCLK  (via drill 0.7)
  Top 0.406: TFT.2 6.17,68.12 7.62,66.67 v7.62,63.37
  Bottom 0.406: v7.62,63.37 8.76,62.23 IC7.15
TFTCS  (via drill 0.7)
  Top 0.406: v29.53,41.43 34.29,36.67 34.29,33.97 38.58,29.69 43.5,29.69 56.99,16.19 56.99,15.24 61.59,10.64 IC1.IO15 | IC7.11 15.49,72.39 16,71.88 16,49.78 TFTCS.MP
  Bottom 0.406: v29.53,41.43 22.95,48.01 TFTCS.MP
TFTCS1
  Bottom 0.406: TFT.3 6.68,70.66 7.49,69.85 IC7.12
TFTDC  (via drill 0.7)
  Top 0.406: v23.91,49.44 23.91,74.3 23.27,74.93 IC7.7 | IC1.IO2 61.91,13.18 59.05,16.03 59.05,18.89 v45.24,32.7
  Bottom 0.406: v23.91,49.44 38.58,34.77 43.18,34.77 v45.24,32.7
TFTDC1
  Bottom 0.406: IC7.6 18.57,72.39 17.3,73.66 7.37,73.66 6.86,73.15 3.86,73.15 TFT.4
TFTMOSI
  Bottom 0.406: IC7.2 17.14,62.23 15.88,63.5 10.79,63.5 8.73,65.56 3.83,65.56 TFT.1
TFTRST
  Bottom 0.406: IC7.10 10.92,74.93 10.16,75.69 3.86,75.69 TFT.5
TX  (via drill 0.7)
  Top 0.406: v61.12,47.78 61.12,54.77 TX.2
  Bottom 0.406: IC1.TX0 61.91,41.12 61.12,41.91 v61.12,47.78
XCS  (via drill 0.7)
  Top 0.406: IC4.XCS 105.57,42.86 104.46,41.75 104.46,39.37 XCS.MP | IC1.IO5 66.2,25.88 66.67,26.35 66.67,34.92 v70.01,38.26
  Bottom 0.406: 104.3,39.37 XCS.MP 102.08,39.21 101.12,38.26 v70.01,38.26
XDCS  (via drill 0.7)
  Top 0.406: IC1.IO16 66.04,20.8 66.67,21.43 66.67,24.13 70.96,28.42 70.96,36.04 v71.75,36.83 | XDCS.MP 110.71,45.98 IC4.XDCS
  Bottom 0.406: XDCS.MP 110.49,39.05 108.27,36.83 v71.75,36.83

### Text on the board
tPlace: 5V | GND | MISO | CLK | GND | CS | GND | 5V | MOSI | 5V | GND | LED | RST | DC/A0 | CS | CLK | MOSI | GND | GND | 3V3 | GND | IR | 5V | 3V3 | GND | IO33 | IO32 | IO14 | ESP32-Radio, Main-Board / tj 2019, Rev. 1.1 | 3V3 | GND | CLK | DT | SW | GND